# Altium schematic sheet DUT_STM32F205RET6.SchDoc
size A4; SheetNumber: 1; SheetTotal: 1
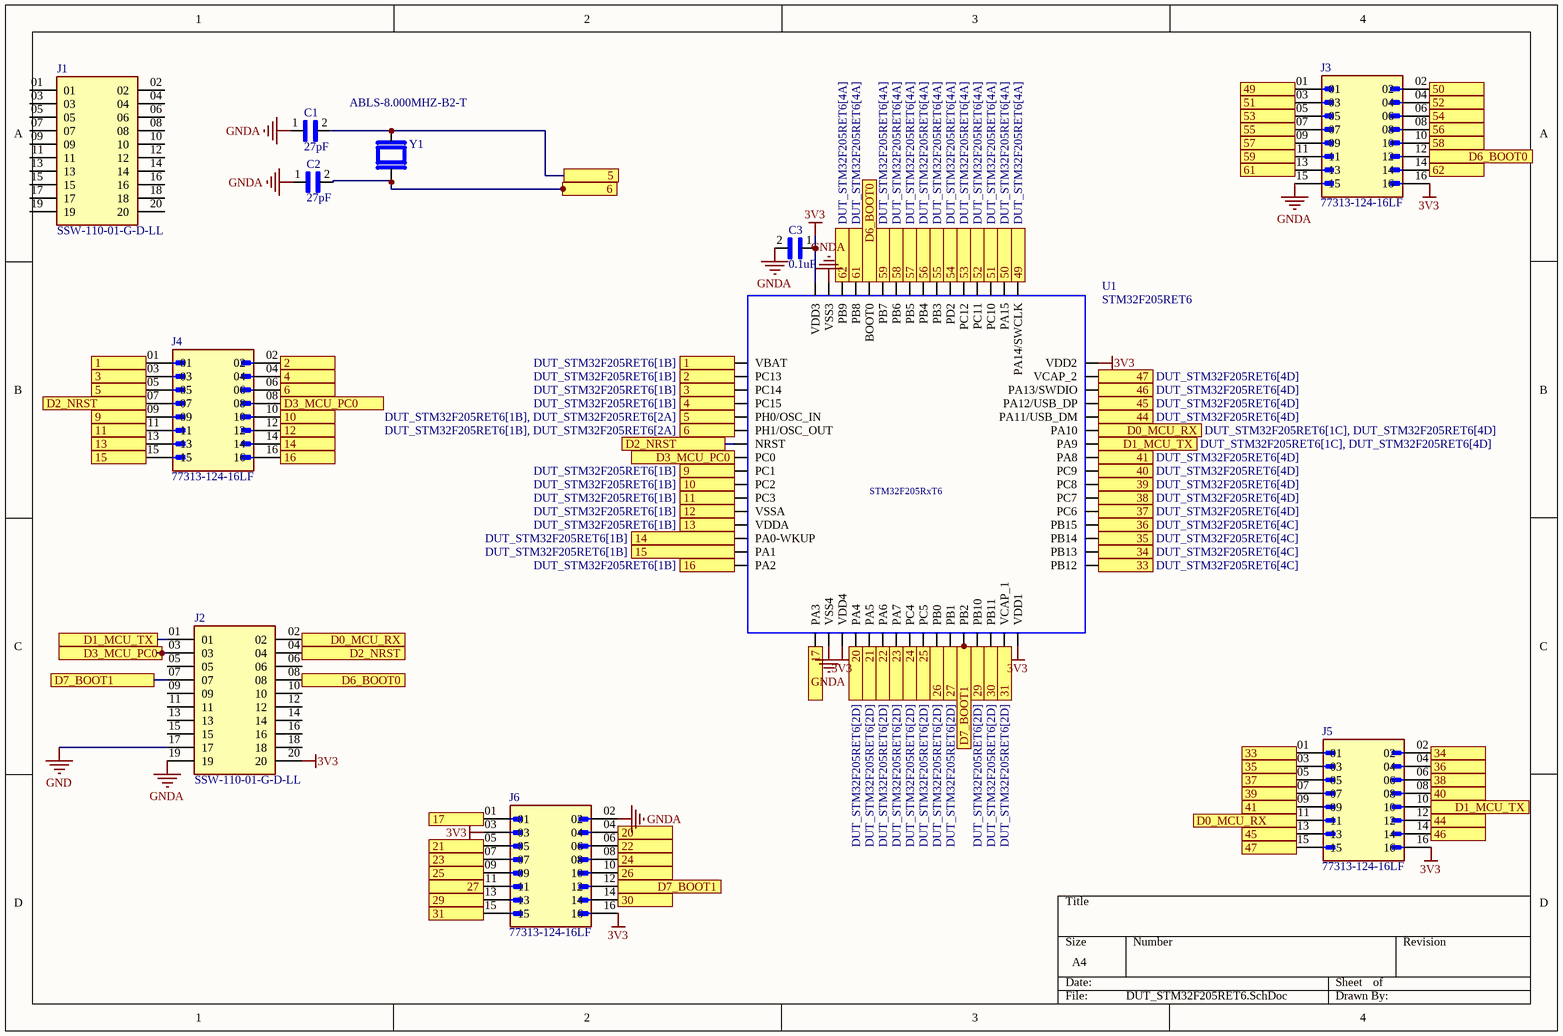
[diagram p0: DUT_STM32F205RET6.SchDoc]

## Parts
C1  27pF  [CAPC1608X90]
C2  27pF  [CAPC1608X90]
C3  0.1uF  [CAPC1608X90]
J1  SSW-110-01-G-D-LL  [SAMTEC_SSW-110-01-G-D-LL]
J2  SSW-110-01-G-D-LL  [SAMTEC_SSW-110-01-G-D-LL]
J3  77313-124-16LF  [AMPHENOL_77313-124-16LF]
J4  77313-124-16LF  [AMPHENOL_77313-124-16LF]
J5  77313-124-16LF  [AMPHENOL_77313-124-16LF]
J6  77313-124-16LF  [AMPHENOL_77313-124-16LF]
U1  STM32F205RET6  [TQFP64-10X10]
Y1  ABLS-8.000MHZ-B2-T  [XTAL_ABLS-8.000MHZ-B2-T]

## Ports
1 (see DUT_STM32F205RET6[1B]), 1 (see DUT_STM32F205RET6[2B]), 2 (see DUT_STM32F205RET6[1B]), 2 (see DUT_STM32F205RET6[2B]), 3 (see DUT_STM32F205RET6[1B]), 3 (see DUT_STM32F205RET6[2B]), 4 (see DUT_STM32F205RET6[1B]), 4 (see DUT_STM32F205RET6[2B]), 5 (see DUT_STM32F205RET6[1B], DUT_STM32F205RET6[2A]), 5 (see DUT_STM32F205RET6[1B], DUT_STM32F205RET6[2B]), 5 (see DUT_STM32F205RET6[2A], DUT_STM32F205RET6[2B]), 6 (see DUT_STM32F205RET6[1B], DUT_STM32F205RET6[2A]), 6 (see DUT_STM32F205RET6[1B], DUT_STM32F205RET6[2B]), 6 (see DUT_STM32F205RET6[2A], DUT_STM32F205RET6[2B]), 9 (see DUT_STM32F205RET6[1B]), 9 (see DUT_STM32F205RET6[2B]), 10 (see DUT_STM32F205RET6[1B]), 10 (see DUT_STM32F205RET6[2B]), 11 (see DUT_STM32F205RET6[1B]), 11 (see DUT_STM32F205RET6[2B]), 12 (see DUT_STM32F205RET6[1B]), 12 (see DUT_STM32F205RET6[2B]), 13 (see DUT_STM32F205RET6[1B]), 13 (see DUT_STM32F205RET6[2C]), 14 (see DUT_STM32F205RET6[1B]), 14 (see DUT_STM32F205RET6[2C]), 15 (see DUT_STM32F205RET6[1B]), 15 (see DUT_STM32F205RET6[2C]), 16 (see DUT_STM32F205RET6[1B]), 16 (see DUT_STM32F205RET6[2C]), 17 (see DUT_STM32F205RET6[2D]), 17 (see DUT_STM32F205RET6[3C]), 20 (see DUT_STM32F205RET6[2D]), 20 (see DUT_STM32F205RET6[3C]), 21 (see DUT_STM32F205RET6[2D]), 21 (see DUT_STM32F205RET6[3C]), 22 (see DUT_STM32F205RET6[2D]), 22 (see DUT_STM32F205RET6[3C]), 23 (see DUT_STM32F205RET6[2D]), 23 (see DUT_STM32F205RET6[3C]), 24 (see DUT_STM32F205RET6[2D]), 24 (see DUT_STM32F205RET6[3C]), 25 (see DUT_STM32F205RET6[2D]), 25 (see DUT_STM32F205RET6[3C]), 26 (see DUT_STM32F205RET6[2D]), 26 (see DUT_STM32F205RET6[3C]), 27 (see DUT_STM32F205RET6[2D]), 27 (see DUT_STM32F205RET6[3C]), 29 (see DUT_STM32F205RET6[2D]), 29 (see DUT_STM32F205RET6[3C]), 30 (see DUT_STM32F205RET6[2D]), 30 (see DUT_STM32F205RET6[3C]), 31 (see DUT_STM32F205RET6[2D]), 31 (see DUT_STM32F205RET6[3C]), 33 (see DUT_STM32F205RET6[3C]), 33 (see DUT_STM32F205RET6[4C]), 34 (see DUT_STM32F205RET6[3C]), 34 (see DUT_STM32F205RET6[4C]), 35 (see DUT_STM32F205RET6[3C]), 35 (see DUT_STM32F205RET6[4C]), 36 (see DUT_STM32F205RET6[3C]), 36 (see DUT_STM32F205RET6[4C]), 37 (see DUT_STM32F205RET6[3B]), 37 (see DUT_STM32F205RET6[4D]), 38 (see DUT_STM32F205RET6[3B]), 38 (see DUT_STM32F205RET6[4D]), 39 (see DUT_STM32F205RET6[3B]), 39 (see DUT_STM32F205RET6[4D]), 40 (see DUT_STM32F205RET6[3B]), 40 (see DUT_STM32F205RET6[4D]), 41 (see DUT_STM32F205RET6[3B]), 41 (see DUT_STM32F205RET6[4D]), 44 (see DUT_STM32F205RET6[3B]), 44 (see DUT_STM32F205RET6[4D]), 45 (see DUT_STM32F205RET6[3B]), 45 (see DUT_STM32F205RET6[4D]), 46 (see DUT_STM32F205RET6[3B]), 46 (see DUT_STM32F205RET6[4D]), 47 (see DUT_STM32F205RET6[3B]), 47 (see DUT_STM32F205RET6[4D]), 49 (see DUT_STM32F205RET6[3B]), 49 (see DUT_STM32F205RET6[4A]), 50 (see DUT_STM32F205RET6[3B]), 50 (see DUT_STM32F205RET6[4A]), 51 (see DUT_STM32F205RET6[3B]), 51 (see DUT_STM32F205RET6[4A]), 52 (see DUT_STM32F205RET6[3B]), 52 (see DUT_STM32F205RET6[4A]), 53 (see DUT_STM32F205RET6[3B]), 53 (see DUT_STM32F205RET6[4A]), 54 (see DUT_STM32F205RET6[3B]), 54 (see DUT_STM32F205RET6[4A]), 55 (see DUT_STM32F205RET6[3B]), 55 (see DUT_STM32F205RET6[4A]), 56 (see DUT_STM32F205RET6[3B]), 56 (see DUT_STM32F205RET6[4A]), 57 (see DUT_STM32F205RET6[3B]), 57 (see DUT_STM32F205RET6[4A]), 58 (see DUT_STM32F205RET6[3B]), 58 (see DUT_STM32F205RET6[4A]), 59 (see DUT_STM32F205RET6[3B]), 59 (see DUT_STM32F205RET6[4A]), 61 (see DUT_STM32F205RET6[3B]), 61 (see DUT_STM32F205RET6[4A]), 62 (see DUT_STM32F205RET6[3B]), 62 (see DUT_STM32F205RET6[4A]), D0_MCU_RX (see DUT_STM32F205RET6[1C], DUT_STM32F205RET6[3B]), D0_MCU_RX (see DUT_STM32F205RET6[1C], DUT_STM32F205RET6[4D]), D0_MCU_RX (see DUT_STM32F205RET6[3B], DUT_STM32F205RET6[4D]), D1_MCU_TX (see DUT_STM32F205RET6[1C], DUT_STM32F205RET6[3B]), D1_MCU_TX (see DUT_STM32F205RET6[1C], DUT_STM32F205RET6[4D]), D1_MCU_TX (see DUT_STM32F205RET6[3B], DUT_STM32F205RET6[4D]), D2_NRST (see DUT_STM32F205RET6[1B], DUT_STM32F205RET6[1C]), D2_NRST (see DUT_STM32F205RET6[1B], DUT_STM32F205RET6[2B]), D2_NRST (see DUT_STM32F205RET6[1C], DUT_STM32F205RET6[2B]), D3_MCU_PC0 (see DUT_STM32F205RET6[1B], DUT_STM32F205RET6[1C]), D3_MCU_PC0 (see DUT_STM32F205RET6[1B], DUT_STM32F205RET6[2B]), D3_MCU_PC0 (see DUT_STM32F205RET6[1C], DUT_STM32F205RET6[2B]), D6_BOOT0 (see DUT_STM32F205RET6[1C], DUT_STM32F205RET6[3B]), D6_BOOT0 (see DUT_STM32F205RET6[1C], DUT_STM32F205RET6[4A]), D6_BOOT0 (see DUT_STM32F205RET6[3B], DUT_STM32F205RET6[4A]), D7_BOOT1 (see DUT_STM32F205RET6[1C], DUT_STM32F205RET6[2D]), D7_BOOT1 (see DUT_STM32F205RET6[1C], DUT_STM32F205RET6[3C]), D7_BOOT1 (see DUT_STM32F205RET6[2D], DUT_STM32F205RET6[3C])

## Nets
3V3: C3.1 J2.20 J3.16 J5.16 J6.03 J6.16 U1.19(VDD4) U1.32(VDD1) U1.48(VDD2) U1.64(VDD3)
GND: J2.17
GNDA: C1.1 C2.1 C3.2 J2.19 J3.15 J6.02 U1.18(VSS4) U1.63(VSS3)
1: J4.01 U1.1(VBAT) ; port 1
2: J4.02 U1.2(PC13) ; port 2
3: J4.03 U1.3(PC14) ; port 3
4: J4.04 U1.4(PC15) ; port 4
5: C1.2 J4.05 U1.5(PH0/OSC_IN) Y1.2 ; port 5
6: C2.2 J4.06 U1.6(PH1/OSC_OUT) Y1.1 ; port 6
9: J4.09 U1.9(PC1) ; port 9
10: J4.10 U1.10(PC2) ; port 10
11: J4.11 U1.11(PC3) ; port 11
12: J4.12 U1.12(VSSA) ; port 12
13: J4.13 U1.13(VDDA) ; port 13
14: J4.14 U1.14(PA0-WKUP) ; port 14
15: J4.15 U1.15(PA1) ; port 15
16: J4.16 U1.16(PA2) ; port 16
17: J6.01 U1.17(PA3) ; port 17
20: J6.04 U1.20(PA4) ; port 20
21: J6.05 U1.21(PA5) ; port 21
22: J6.06 U1.22(PA6) ; port 22
23: J6.07 U1.23(PA7) ; port 23
24: J6.08 U1.24(PC4) ; port 24
25: J6.09 U1.25(PC5) ; port 25
26: J6.10 U1.26(PB0) ; port 26
27: J6.11 U1.27(PB1) ; port 27
29: J6.13 U1.29(PB10) ; port 29
30: J6.14 U1.30(PB11) ; port 30
31: J6.15 U1.31(VCAP_1) ; port 31
33: J5.01 U1.33(PB12) ; port 33
34: J5.02 U1.34(PB13) ; port 34
35: J5.03 U1.35(PB14) ; port 35
36: J5.04 U1.36(PB15) ; port 36
37: J5.05 U1.37(PC6) ; port 37
38: J5.06 U1.38(PC7) ; port 38
39: J5.07 U1.39(PC8) ; port 39
40: J5.08 U1.40(PC9) ; port 40
41: J5.09 U1.41(PA8) ; port 41
44: J5.12 U1.44(PA11/USB_DM) ; port 44
45: J5.13 U1.45(PA12/USB_DP) ; port 45
46: J5.14 U1.46(PA13/SWDIO) ; port 46
47: J5.15 U1.47(VCAP_2) ; port 47
49: J3.01 U1.49(PA14/SWCLK) ; port 49
50: J3.02 U1.50(PA15) ; port 50
51: J3.03 U1.51(PC10) ; port 51
52: J3.04 U1.52(PC11) ; port 52
53: J3.05 U1.53(PC12) ; port 53
54: J3.06 U1.54(PD2) ; port 54
55: J3.07 U1.55(PB3) ; port 55
56: J3.08 U1.56(PB4) ; port 56
57: J3.09 U1.57(PB5) ; port 57
58: J3.10 U1.58(PB6) ; port 58
59: J3.11 U1.59(PB7) ; port 59
61: J3.13 U1.61(PB8) ; port 61
62: J3.14 U1.62(PB9) ; port 62
D0_MCU_RX: J2.02 J5.11 U1.43(PA10) ; port D0_MCU_RX
D1_MCU_TX: J2.01 J5.10 U1.42(PA9) ; port D1_MCU_TX
D2_NRST: J2.04 J4.07 U1.7(NRST) ; port D2_NRST
D3_MCU_PC0: J2.03 J4.08 U1.8(PC0) ; port D3_MCU_PC0
D6_BOOT0: J2.08 J3.12 U1.60(BOOT0) ; port D6_BOOT0
D7_BOOT1: J2.07 J6.12 U1.28(PB2) ; port D7_BOOT1

Not connected (* = marked no-connect by the designer): J1 01 02 03 04 05 06 07 08 09 10 11 12 13 14 15 16 17 18 19 20; J2 05 06 09 10 11 12 13 14 15 16 18

## Notes on the sheet
- (in symbol STM32F205RCT6) STM32F205RxT6

## Library data of the parts
C1 C2 = CC0603MRX5R7BB106: 0603; Package: None; Price: None; Value: *; MP: CC0603MRX5R7BB106; Availability: Unavailable
C3 = CC0603MRX5R7BB106: CAP CER 10UF 16V X5R 0603; Package: None; Price: None; Value: *; MP: CC0603MRX5R7BB106; Availability: Unavailable
J1 J2 = SSW-110-01-G-D-LL: MF: Samtec Inc.; Value: *; Availability: Unavailable; Package: None; Price: None; MP: SSW-110-01-G-D-LL
J3-J6 = 77313-124-16LF: BergStikÂ®, Board to Board connector, Unshrouded Header, 2.54 mm Pitch, Vertical, Double Row,Through Hole, 16 Positions; MF: Amphenol ICC (FCI); SnapEDA_Link: https://www.snapeda.com/parts/77313-124-16LF/Amphenol+FCI/view-part/?ref=snap; Package: None; Value: *; MP: 77313-124-16LF; Check_prices: https://www.snapeda.com/parts/77313-124-16LF/Amphenol+FCI/view-part/?ref=eda
U1 = STM32F205RCT6: ARMÂ® CortexÂ®-M3 STM32F2 Microcontroller IC 32-Bit 120MHz 256KB _256K x 8_ FLASH 64-LQFP _10x10_; MF: STMicroelectronics; Availability: Unavailable; MP: STM32F205RCT6; Price: None; Value: *; SnapEDA_Link: https://www.snapeda.com/parts/STM32F205RCT6/STMicroelectronics/view-part/563762/?ref=snap; Package: LQFP-64 STMicroelectronics
Y1 = ABLS-8.000MHZ-B2-T: HC/49US (AT49) SMD LOW PROFILE CRYSTAL; MF: Abracon LLC; Availability: In Stock; Purchase-URL: https://pricing.snapeda.com/search/part/ABLS-8.000MHZ-B2-T/?ref=eda; Package: HC49/US Abracon; MP: ABLS-8.000MHZ-B2-T; Value: *; Check_prices: https://www.snapeda.com/parts/ABLS-8.000MHZ-B2-T/Abracon+LLC/view-part/?ref=eda; SnapEDA_Link: https://www.snapeda.com/parts/ABLS-8.000MHZ-B2-T/Abracon+LLC/view-part/?ref=snap; Price: None